# Altium schematic sheet breakout.SchDoc
size A; SheetNumber: 1; SheetTotal: 2
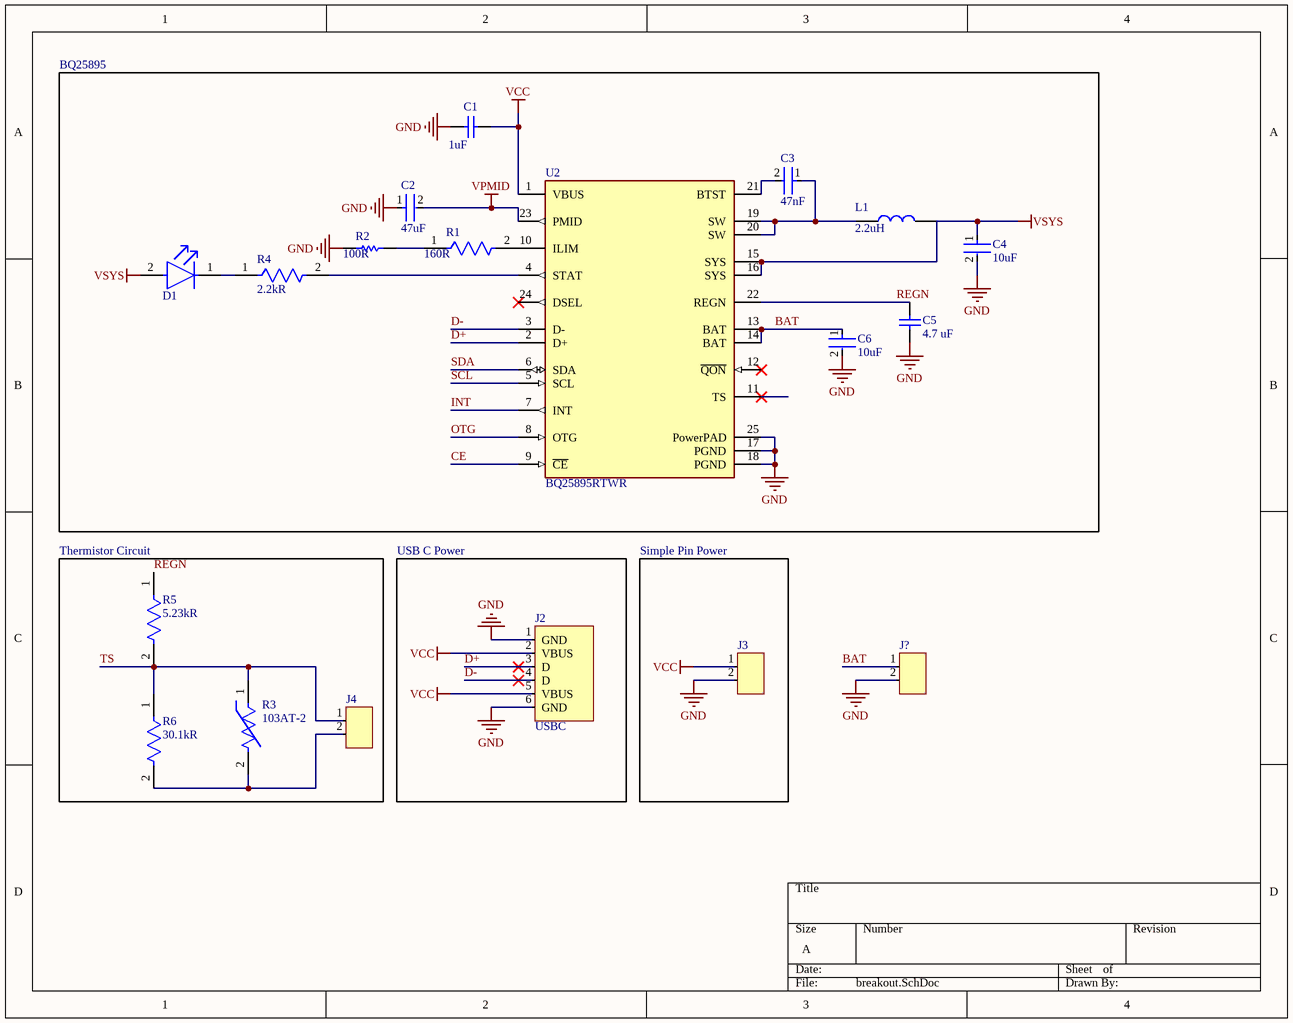
[diagram p0: breakout.SchDoc]

## Parts
C1  value 1uF  [CAPC2013X140X50LL20T25]  (hidden comment: C0805C105K3RACTU)
C2  value 47uF  [47uf 0805 SMD]  (hidden comment: 47uf 0805 SMD)
C3  value 47nF  [47uf 0805 SMD]  (hidden comment: 47nf 0805 SMD)
C4  value 10uF  [FP-C0805C-DG-MFG]  (hidden comment: C0805C106K8PACTU)
C5  Capacitance: 4.7 uF  [CAPC2013X135X45LL10T25]  (hidden comment: GRM21BR61C475KA88L)
C6  value 10uF  [FP-C0805C-DG-MFG]  (hidden comment: C0805C106K8PACTU)
D1  BL-HUF35A-AV-TRB  [FP-BL-HUF35A-AV-TRB-MFG]  (value not drawn)
J2  USBC  [USBC]
J3  2pin 2.54mm header  [2.54mm 2pin header]  (value not drawn)
J4  2pin 2.54mm header  [2.54mm 2pin header]  (value not drawn)
J?  2pin 2.54mm header  [2.54mm 2pin header]  (value not drawn)
L1  value 2.2uH  [2.2uH Inductor]  (hidden comment: 2.2uH Inductor)
R1  Resistance: 160R  [FP-CRCW0805-e3-IPC_C]  (hidden comment: CRCW0805160RFKEA)
R2  value 100R  [RESC2013X60X40ML20T25]  (hidden comment: ERA6AEB101V)
R3  103AT-2  [FP-103AT-2-MFG]
R4  Resistance: 2.2kR  [FP-CRCW0805-e3-IPC_B]  (hidden comment: CRCW08052K20FKEA)
R5  Resistance: 5.23kR  [FP-CRCW0805-e3-IPC_B]  (hidden comment: CRCW08055K23FKEA)
R6  Resistance: 30.1kR  [FP-CRCW0805-e3-IPC_B]  (hidden comment: CRCW08052K20FKEA)
U2  BQ25895RTWR  [FP-RTW0024H-IPC_B]

## Blocks framed on the sheet
BQ25895: C1-C6 D1 L1 R1 R2 R4 U2
Thermistor Circuit: J4 R3 R5 R6
USB C Power: J2
Simple Pin Power: J3

## Nets
GND: C1.1 C2.1 C4.2 C5.2 C6.2 J2.1(GND) J2.6(GND) J3.2 J?.2 R2.1 U2.17(PGND) U2.18(PGND) U2.25(PowerPAD)
VCC: C1.2 J2.2(VBUS) J2.5(VBUS) J3.1 U2.1(VBUS)
VPMID: C2.2 U2.23(PMID)
VSYS: C4.1 D1.2(A) U2.15(SYS) U2.16(SYS)
BAT: C6.1 J?.1 U2.13(BAT) U2.14(BAT)
CE: U2.9(~{CE})
D+: J2.3(D) U2.2(D+)
D-: J2.4(D) U2.3(D-)
INT: U2.7(INT)
OTG: U2.8(OTG)
REGN: C5.1 R5.1 U2.22(REGN)
SCL: U2.5(SCL)
SDA: U2.6(SDA)
TS: J4.1 R3.1 R5.2 R6.1
NetC3_1: C3.1 U2.19(SW) U2.20(SW)
NetC3_2: C3.2 U2.21(BTST)
NetD1_1: D1.1(C) R4.1
NetJ4_2: J4.2 R3.2 R6.2
NetR1_1: R1.1 R2.2
NetR1_2: R1.2 U2.10(ILIM)
NetR4_2: R4.2 U2.4(STAT)

Not connected (* = marked no-connect by the designer): U2 11(TS)* 12(~{QON})* 24(DSEL)*

## Library data of the parts
C1 = CMP-2007-03234-1: Manufacturer: Kemet; Part Number: C0805C105K3RACTU; LCSC: C28323
C2 C3 = 47uf 0805 SMD: Ceramic Capacitor, Multilayer, Ceramic, 6.3V, 20% +Tol, 20% -Tol, X5R, 15% TC, 47uF, Surface Mount, 0805; Manufacturer: KEMET; Manufacturer Part Number: C0805C476M9PACTU; Multilayer: Yes; Supplier: Mouser; Supplier Part Number: 80-C0805C476M9P; RoHS: Yes; Category: Ceramic Capacitors; Stock: 168175; Pricing: 1=0.87, 10=0.561, 50=0.561, 100=0.438, 1000=0.436, 10000=0.247 (USD); Mounting Technology: Surface Mount; Pins: 2; Dielectric Material: Ceramic; Package Shape: Rectangular; Case/Package: 0805; Terminal Finish: Nickel; Min Operating Temperature: -55°C; Max Operating Temperature: 85°C; JESD-609 Code: e3; Capacitor Type: Ceramic; Tolerance  (fill in as +-): 20%; Package Style: SMTMeter; Packaging: Tape and Reel; Tolerance (fill in as +-): 20%; Rated DC Voltage (URdc): 6.3V; Temperature Characteristics Code: X5R; Termination: Wraparound; Length: 2mm; Width: 1.25mm; Height: 1.25mm; Reach SVHC Compliant: Yes; RoHS Compliant: Yes; ComponentLink1URL: https://datasheet.ciiva.com:443/pdfs/VipMasterIC/IC/KEME/KEME-S-A0008991665/KEME-S-A0008991665-1.pdf?src-supplier=IHS+Markit; ComponentLink1Description: https://datasheet.ciiva.com:443/pdfs/VipMasterIC/IC/KEME/KEME-S-A0008991665/KEME-S-A0008991665-1.pdf?src-supplier=IHS+Markit; ComponentLink2URL: https://datasheet.ciiva.com/7842/40889-7842618.pdf?src-supplier=Element14; ComponentLink2Description: https://datasheet.ciiva.com/7842/40889-7842618.pdf?src-supplier=Element14; ComponentLink3URL: https://datasheet.ciiva.com/6137/40889-6137142.pdf?src-supplier=Farnell; ComponentLink3Description: https://datasheet.ciiva.com/6137/40889-6137142.pdf?src-supplier=Farnell
  C2: LCSC: C16780
  C3: LCSC: C2915681
C4 C6 = CMP-2007-03243-2: CAP CER 10UF 10V X5R 0805; Manufacturer: Kemet; 3DS Part Number: 220-00001; Tolerance: 10%; Temperature Coefficient: 15%; Material: Ceramic; Device Class L2: Capacitors; Device Class L1: Passive Components; ComponentLink2URL: https://content.kemet.com/datasheets/KEM_C1006_X5R_SMD.pdf; Height: 1.4mm; Lead Free: Yes; Manufacturer Part Number: C0805C106K8PACTU; Digikey Description: CAP CER 10UF 10V X5R 0805; Octopart: https://octopart.com/c0805c106k8pactu-kemet-98697; Capacitance: 10uF; Temperature Range Low: -55°C; Temperature: -55°C to +85°C; Automotive: No; Mouser Description: CAP CER 10UF 10V X5R 0805; Ipc Land Pattern Name: CAPC200125X125; Temperature Range High: +85°C; Voltage: 10V; RoHS: TRUE; Device Class L3: Ceramic Capacitors; ComponentLink2Description: Datasheet; Voltage Rating: 10V; Package: C0805C-DG; Temperature Characteristic: X5R; Category: Cap; LCSC: C15850
C5 = CMP-1662-00015-2: Chip Capacitor, 4.7 uF, +/- 10%, 16 V, -55 to 85 degC, 0805 (2012 Metric), RoHS, Tape and Reel; Voltage Rating (DC): 16 V; Type (Capacitors): X5R; Case\/Package: 0805; Pins: 2; DatasheetVersion: 03/2016; REACH SVHC: No SVHC; Tolerance: 10%; PartNumber: GRM21BR61C475KA88L; Width: 1.25 mm; Mount: Surface Mount; ComponentLink1Description: Manufacturer URL; Case Code (Metric): 2012; PackageDescription: 2-Pin Surface Mount Device, Body 2 x 1.25 mm; Height: 1.25 mm; Voltage Rating: 16 V; Max Operating Temperature: 85 degC; RoHSCompliant: true; Length: 2 mm; ComponentLink1URL: http://www.murata.com/; Mounting Technology: Surface Mount; Packaging: Tape and Reel; Min Operating Temperature: -55 degC; ComponentLink2Description: Datasheet; Case Code (Imperial): 0805; Radiation Hardening: No; Package Quantity: 3000; PackageReference: 0805; ComponentLink2URL: http://search.murata.co.jp/Ceramy/image/img/A01X/G101/ENG/GRM21BR61C475KA88-01.pdf; LCSC: C1779
D1 = CMP-03430-128560092-1: Reverse Voltage: 5V; Color: Red; Viewing Angle: 120°; Forward Current: 20mA; Luminous Intensity: 80mcd; Power Dissipation: 50mW; Forward Voltage: 2.2V; Wavelength: 635nm; NexarPartId: 128560092; Max Operating Temperature: 85°C; Min Operating Temperature: -40°C; Case/Package: 0805; Height: 1.1mm; LCSC: C94741
L1 = 2.2uH Inductor: ±20% 6.5A 6A Integrated molded inductor 2.2uH SMD,4x4mm Power Inductors ROHS; Current: 6A; LCSC: C20417190
R1 = CMP-1013-00418-2: RES Thick Film, 160Ω, 1%, 0.125W, 100ppm/°C, 0805; Voltage Rating (DC): 150V; Max Power Dissipation: 125mW; Termination: SMD/SMT; Min Operating Temperature: -55°C; Number of Terminations: 2; Number of Pins: 2; Composition: Thick Film; Voltage Rating: 150V; Length: 2mm; Tolerance: 1%; Case Code (Metric): 2012; Case/Package: 0805; Width: 0.049inch; Packaging: Tape and Reel; Temperature Coefficient: 100ppm/°C; Power Rating: 125mW; Max Operating Temperature: 155°C; Military Standard: Not; Lead Free: Lead Free; Features: Automotive AEC-Q200; Height: 0.02inch; Package Quantity: 10; Depth: 1.25mm; Case Code (Imperial): 0805; Weight: 0.000194oz; LCSC: C25269
R2 = CMP-2001-00580-1: Manufacturer: Panasonic; Part Number: ERA6AEB101V; LCSC: C25269
R3 = CMP-2000-05824-2: Thermistor NTC 10KOhm 1% 2-Pin; Resistance: 10kR; Lead Pitch: 2.54mm; Height: 2.4mm; Max Operating Temperature: 110°C; Width: 3.7mm; RoHS Compliant: Yes; Min Operating Temperature: -50°C; Termination: Radial; Packaging: Bulk; Number of Pins: 2; Series: AT; Tolerance: 1%; Length: 17mm
R4 R6 = CMP-2001-03760-2: RES Thick Film, 2.2kΩ, 1%, 0.125W, 100ppm/°C, 0805; Voltage Rating (DC): 150V; Max Power Dissipation: 125mW; Case/Package: 0805; Width: 1.25mm; Voltage Rating: 150V; Composition: Thick Film; Power Rating: 125mW; Packaging: Tape and Reel; Min Operating Temperature: -55°C; Contact Plating: Tin; Tolerance: 1%; Military Standard: Not; Case Code (Metric): 2012; Radiation Hardening: No; Termination: SMD/SMT; Lead Free: Lead Free; Case Code (Imperial): 0805; Max Operating Temperature: 155°C; Depth: 1.25mm; Weight: 0.000194oz; Number of Terminations: 2; Length: 2mm; Package Quantity: 10; Temperature Coefficient: 100ppm/°C; Features: Automotive AEC-Q200; Height: 0.45mm
  R4: LCSC: C163971
  R6: LCSC: C21841
R5 = CMP-2001-04027-2: RES Thick Film, 5.23kΩ, 1%, 0.125W, 100ppm/°C, 0805; Power Rating: 125mW; Working Voltage: 150V; Weight: 0.000194oz; Package Quantity: 10; Height: 0.45mm; Termination: SMD/SMT; Depth: 1.25mm; Max Operating Temperature: 155°C; Case/Package: 0805; Width: 1.25mm; Number of Terminations: 2; Packaging: Tape and Reel; Temperature Coefficient: 100ppm/°C; Military Standard: Not; Contact Plating: Tin; Case Code (Metric): 2012; Number of Pins: 2; Max Power Dissipation: 125mW; Composition: Thick Film; Tolerance: 1%; Lead Free: Lead Free; Voltage Rating (DC): 150V; Case Code (Imperial): 0805; Voltage Rating: 150V; Length: 2mm; Features: Automotive AEC-Q200; Min Operating Temperature: -55°C; LCSC: C2933464
U2 = CMP-04911-000061-1: IC NVDC CHARGER I2C 24WQFN; Output Current: 5A; Number of Cells: 1; Output Voltage: 4.6V; Operating Supply Voltage: 14V; Max Operating Temperature: 85°C; Lead Free: Lead Free; Contact Plating: Gold; RoHS Compliant: Yes; Mount: Surface Mount; Min Operating Temperature: -40°C
J2 = USBC: LCSC: C5187411